# EasyEDA schematic prjct_1.json
TITLE: Sheet_1; REV: 1.0; Date: 2023-04-16; Sheet: 1/1; Company: Your Company
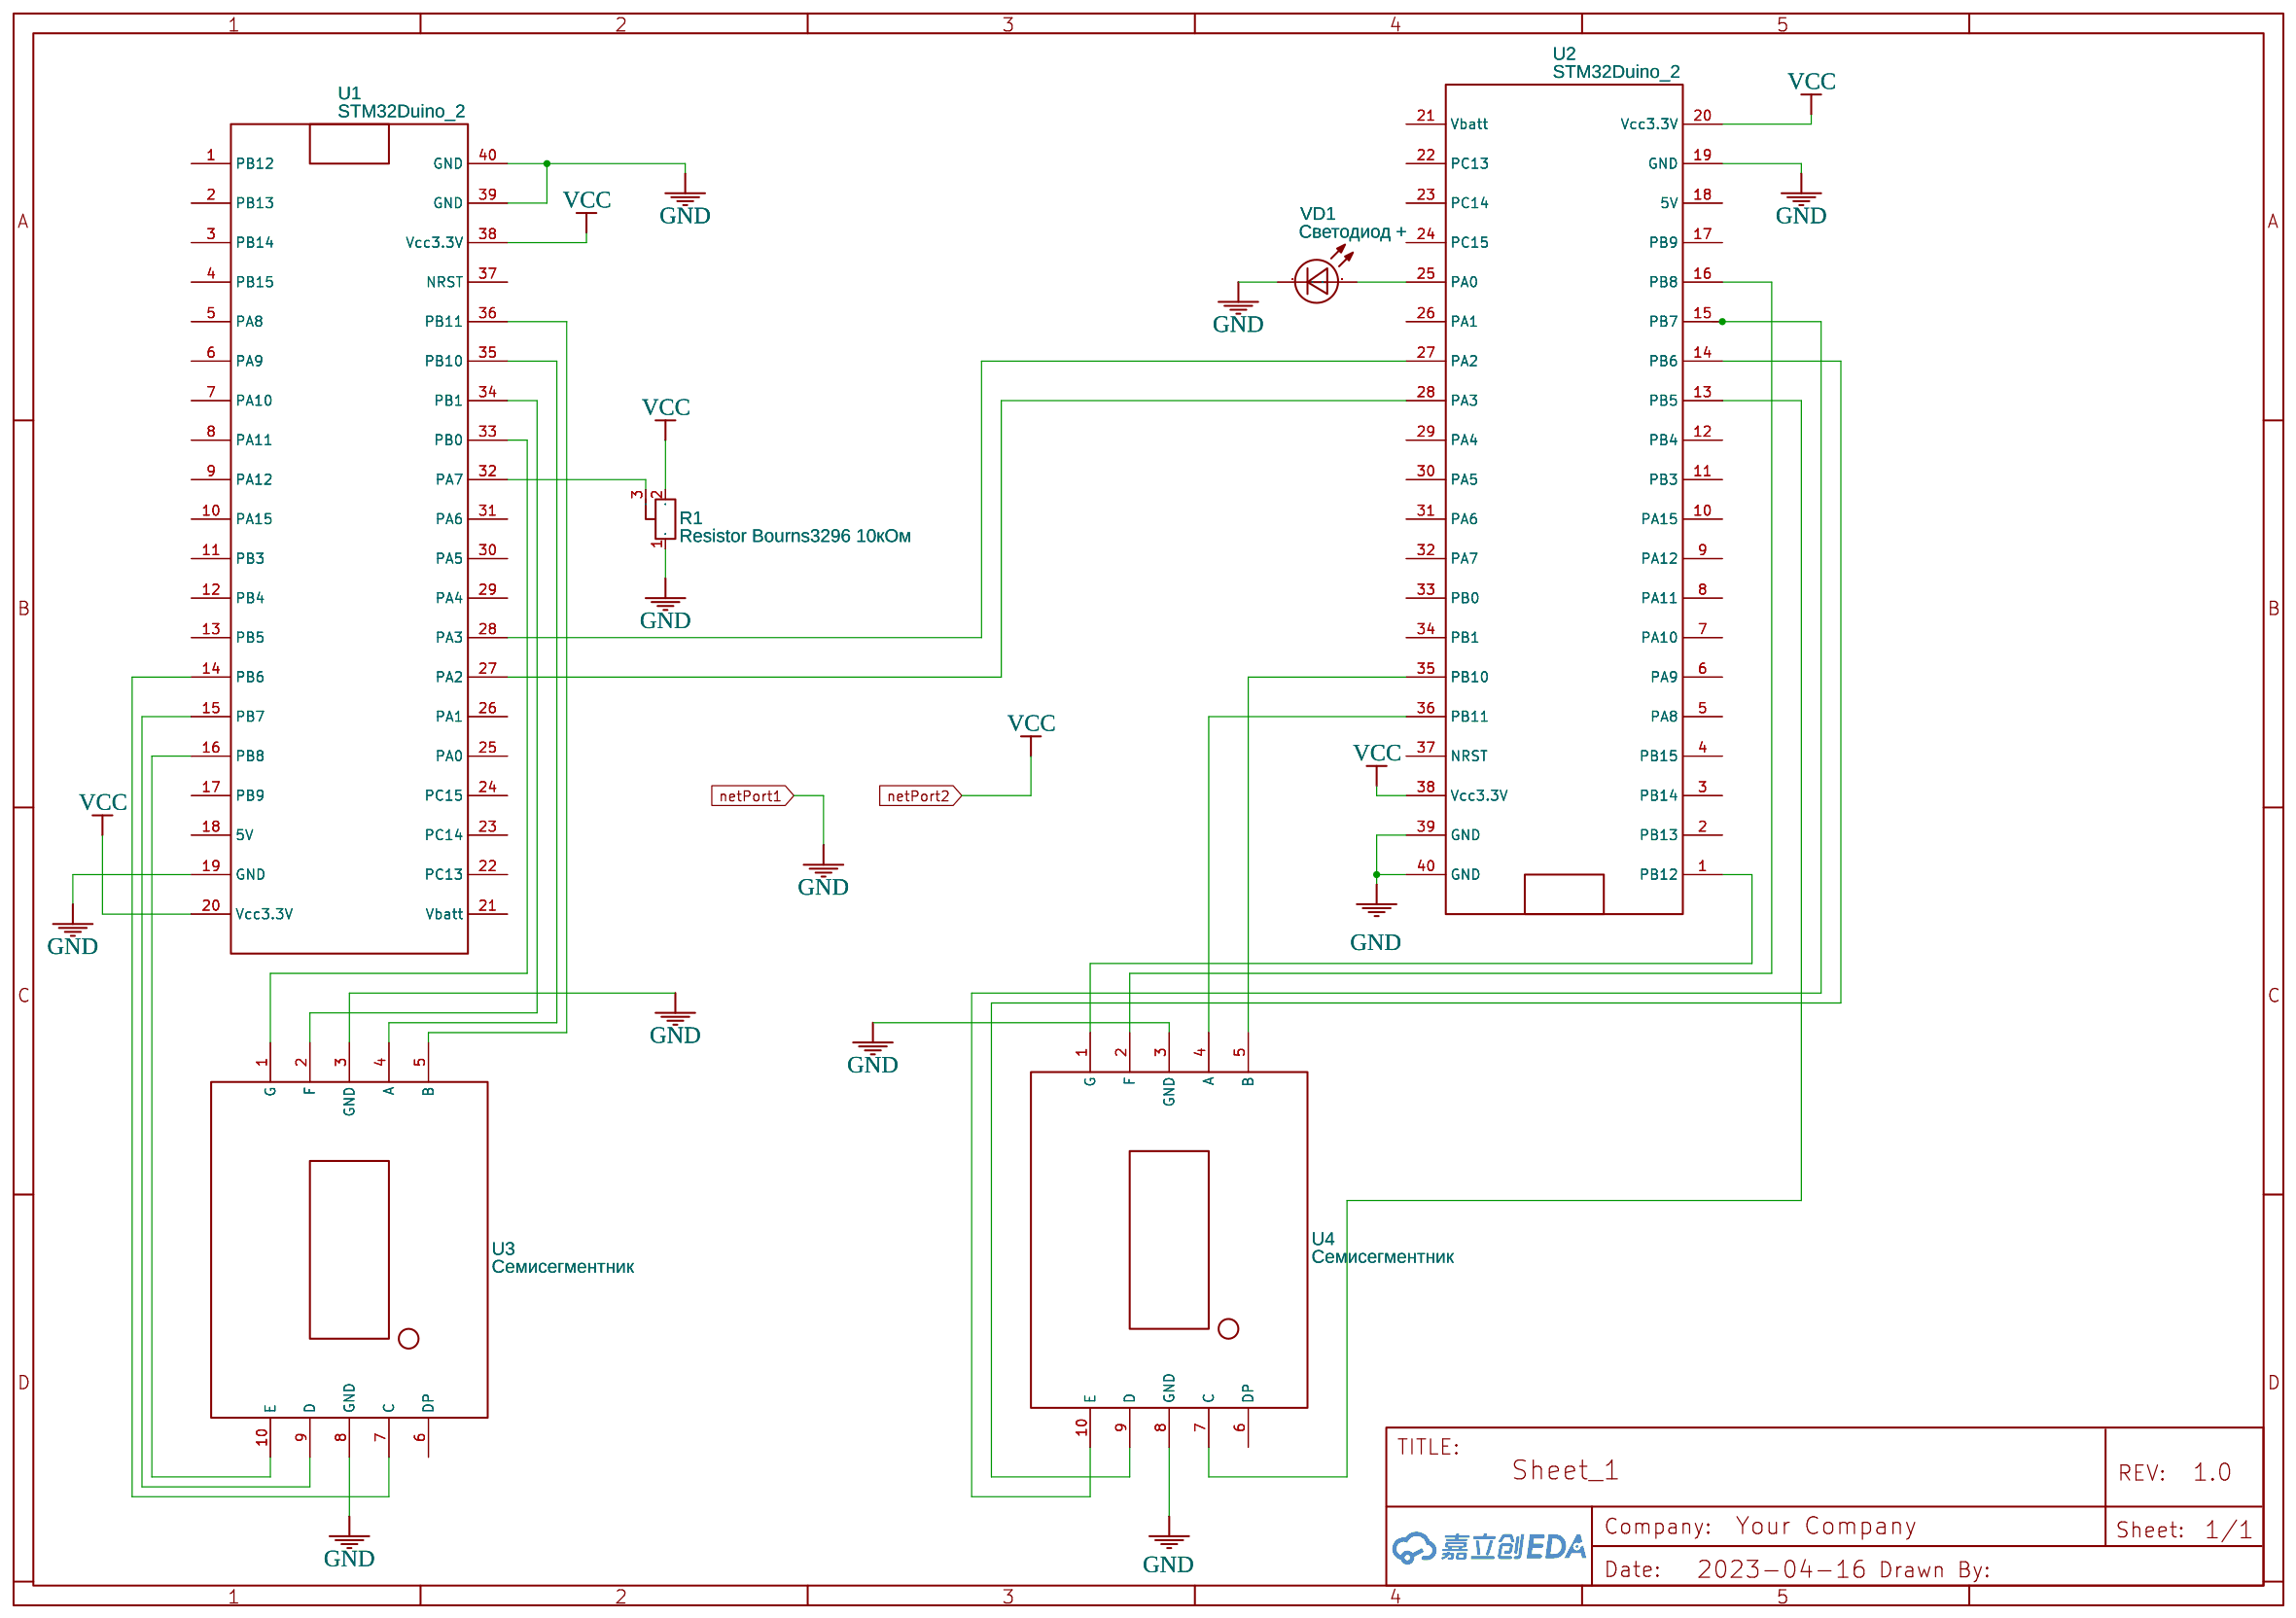
[diagram p0: schematic sheet]

## Parts
R1  Resistor Bourns3296 10кОм  [BOURNS3296 10КОМ]
U1  STM32Duino_2  [STM32F103C8T6-BLUEPILL]
U2  STM32Duino_2  [STM32F103C8T6-BLUEPILL]
U3  Семисегментник  [СЕМИСЕГМЕНТНИК(34)]
U4  Семисегментник  [СЕМИСЕГМЕНТНИК(34)]
VD1  Светодиод +  [СВЕТОДИОД +]

## Library data of the parts
R1 = Resistor Bourns3296 10кОм: Manufacturer: Bourns; Contributor: kudgar
U1 U2 = STM32Duino_2: Manufacturer Part: STM32Duino; Contributor: zsteva
U3 U4 = Семисегментник: Contributor: christop278
VD1 = Светодиод +: Manufacturer Part: Светодиод; Contributor: nick717

## Nets
GND: R1.1 U1.19(GND) U1.39(GND) U1.40(GND) U2.19(GND) U2.39(GND) U2.40(GND) U3.3(GND) U3.8(GND) U4.3(GND) U4.8(GND) VD1.2
VCC: R1.2 U1.20(Vcc3.3V) U1.38(Vcc3.3V) U2.20(Vcc3.3V) U2.38(Vcc3.3V)
Net-(R1-3): R1.3 U1.32(PA7)
Net-(U1-14): U1.14(PB6) U3.7(C)
Net-(U1-15): U1.15(PB7) U3.9(D)
Net-(U1-16): U1.16(PB8) U3.10(E)
Net-(U1-27): U1.27(PA2) U2.28(PA3)
Net-(U1-28): U1.28(PA3) U2.27(PA2)
Net-(U1-33): U1.33(PB0) U3.1(G)
Net-(U1-34): U1.34(PB1) U3.2(F)
Net-(U1-35): U1.35(PB10) U3.4(A)
Net-(U1-36): U1.36(PB11) U3.5(B)
Net-(U2-1): U2.1(PB12) U4.1(G)
Net-(U2-13): U2.13(PB5) U4.7(C)
Net-(U2-14): U2.14(PB6) U4.9(D)
Net-(U2-15): U2.15(PB7) U4.10(E)
Net-(U2-16): U2.16(PB8) U4.2(F)
Net-(U2-25): U2.25(PA0) VD1.1
Net-(U2-35): U2.35(PB10) U4.5(B)
Net-(U2-36): U2.36(PB11) U4.4(A)

Not connected (* = marked no-connect by the designer): U1 1(PB12) 2(PB13) 3(PB14) 4(PB15) 5(PA8) 6(PA9) 7(PA10) 8(PA11) 9(PA12) 10(PA15) 11(PB3) 12(PB4) 13(PB5) 17(PB9) 18(5V) 21(Vbatt) 22(PC13) 23(PC14) 24(PC15) 25(PA0) 26(PA1) 29(PA4) 30(PA5) 31(PA6) 37(NRST); U2 2(PB13) 3(PB14) 4(PB15) 5(PA8) 6(PA9) 7(PA10) 8(PA11) 9(PA12) 10(PA15) 11(PB3) 12(PB4) 17(PB9) 18(5V) 21(Vbatt) 22(PC13) 23(PC14) 24(PC15) 26(PA1) 29(PA4) 30(PA5) 31(PA6) 32(PA7) 33(PB0) 34(PB1) 37(NRST); U3 6(DP); U4 6(DP)
